# EAGLE design pardisplay (EAGLE 7.6.0)
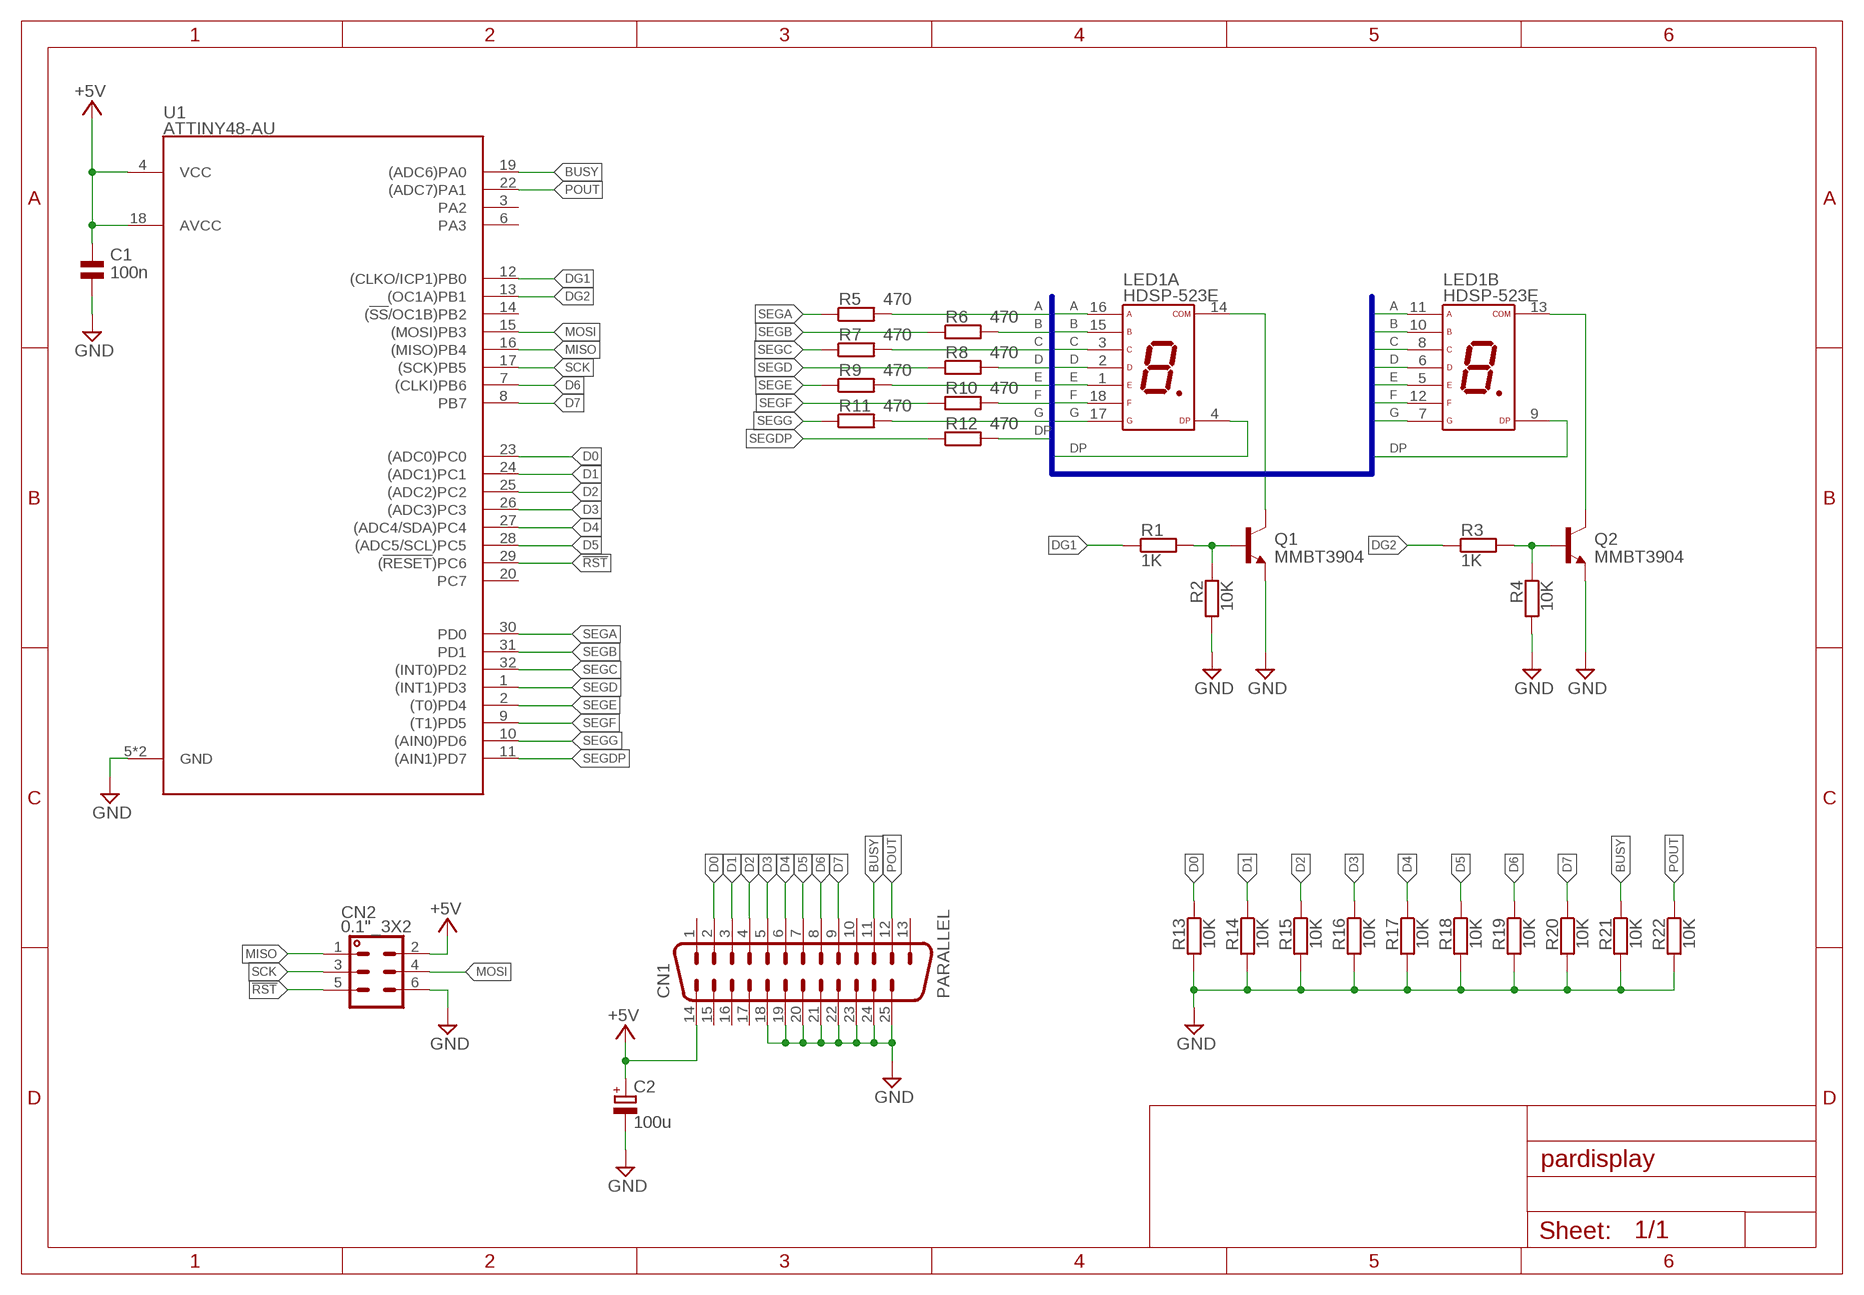
[diagram p0: schematic, sheet 1]

## Parts
C1  100n  CAP_NPOL-0603  [0603]
C2  100u  CPOL-EUUD-6,3X8,8  [UD-6,3X5,8_NICHICON]
CN1  PARALLEL  M25HP  [M25HP]
CN2  0.1"_3X2  [0.1"_3X2-LONG]
LED1  HDSP-523E  KINGBRIGHT_DA56  [DA56]
Q1  MMBT3904  -NPN_SOT23  [SOT23]
Q2  MMBT3904  -NPN_SOT23  [SOT23]
R1  1K  RES-SMD_0603  [0603]
R2  10K  RES-SMD_0603  [0603]
R3  1K  RES-SMD_0603  [0603]
R4  10K  RES-SMD_0603  [0603]
R5  470  RES-SMD_0603  [0603]
R6  470  RES-SMD_0603  [0603]
R7  470  RES-SMD_0603  [0603]
R8  470  RES-SMD_0603  [0603]
R9  470  RES-SMD_0603  [0603]
R10  470  RES-SMD_0603  [0603]
R11  470  RES-SMD_0603  [0603]
R12  470  RES-SMD_0603  [0603]
R13  10K  RES-SMD_0603  [0603]
R14  10K  RES-SMD_0603  [0603]
R15  10K  RES-SMD_0603  [0603]
R16  10K  RES-SMD_0603  [0603]
R17  10K  RES-SMD_0603  [0603]
R18  10K  RES-SMD_0603  [0603]
R19  10K  RES-SMD_0603  [0603]
R20  10K  RES-SMD_0603  [0603]
R21  10K  RES-SMD_0603  [0603]
R22  10K  RES-SMD_0603  [0603]
U1  ATTINY48-AU  [TQFP32-08]

## Nets
!RST: CN2.5 U1.29((!RESET!)PC6)
+5V: C1.1 C2.+ CN1.14 CN2.2 U1.4(VCC) U1.18(AVCC)
A: LED1.11(B:A) LED1.16(A:A) R5.2
B: LED1.10(B:B) LED1.15(A:B) R6.2
BUSY: CN1.11 R21.1 U1.19((ADC6)PA0)
C: LED1.3(A:C) LED1.8(B:C) R7.2
COM1: LED1.14(A:COM) Q1.3(C)
COM2: LED1.13(B:COM) Q2.3(C)
D: LED1.2(A:D) LED1.6(B:D) R8.2
D0: CN1.2 R13.1 U1.23((ADC0)PC0)
D1: CN1.3 R14.1 U1.24((ADC1)PC1)
D2: CN1.4 R15.1 U1.25((ADC2)PC2)
D3: CN1.5 R16.1 U1.26((ADC3)PC3)
D4: CN1.6 R17.1 U1.27((ADC4/SDA)PC4)
D5: CN1.7 R18.1 U1.28((ADC5/SCL)PC5)
D6: CN1.8 R19.1 U1.7((CLKI)PB6)
D7: CN1.9 R20.1 U1.8(PB7)
DG1: R1.1 U1.12((CLKO/ICP1)PB0)
DG2: R3.1 U1.13((OC1A)PB1)
DP: LED1.4(A:DP) LED1.9(B:DP) R12.2
E: LED1.1(A:E) LED1.5(B:E) R9.2
F: LED1.12(B:F) LED1.18(A:F) R10.2
G: LED1.7(B:G) LED1.17(A:G) R11.2
GND: C1.2 C2.- CN1.18 CN1.19 CN1.20 CN1.21 CN1.22 CN1.23 CN1.24 CN1.25 CN2.6 Q1.2(E) Q2.2(E) R2.2 R4.2 R13.2 R14.2 R15.2 R16.2 R17.2 R18.2 R19.2 R20.2 R21.2 R22.2 U1.5(GND) U1.21(GND)
MISO: CN2.1 U1.16((MISO)PB4)
MOSI: CN2.4 U1.15((MOSI)PB3)
N$11: Q1.1(B) R1.2 R2.1
N$12: Q2.1(B) R3.2 R4.1
POUT: CN1.12 R22.1 U1.22((ADC7)PA1)
SCK: CN2.3 U1.17((SCK)PB5)
SEGA: R5.1 U1.30(PD0)
SEGB: R6.1 U1.31(PD1)
SEGC: R7.1 U1.32((INT0)PD2)
SEGD: R8.1 U1.1((INT1)PD3)
SEGDP: R12.1 U1.11((AIN1)PD7)
SEGE: R9.1 U1.2((T0)PD4)
SEGF: R10.1 U1.9((T1)PD5)
SEGG: R11.1 U1.10((AIN0)PD6)
Unconnected: CN1.1 CN1.10 CN1.13 CN1.15 CN1.16 CN1.17 U1.3(PA2) U1.6(PA3) U1.14((!SS!/OC1B)PB2) U1.20(PC7)

## Buses
A,B,C,D,E,F,G,DP

## Library data of the parts
C1 = jc-passive:CAP_NPOL
C2 = rcl:CPOL-EU: POLARIZED CAPACITOR, European symbol
CN1 = con-subd:M25: SUB-D; OC_FARNELL: unknown; OC_NEWARK: unknown
CN2 = jc-connectors:0.1"_3X2; LABEL: ISP
LED1 = jc-display:KINGBRIGHT_DA56: Kingbright DA56 series Avago HDSP-52X series
Q1 Q2 = jc-discretesemi:*-NPN_?
R1-R22 = jc-passive:RES
U1 = jc-atmel avr:ATTINY*8-

## Board
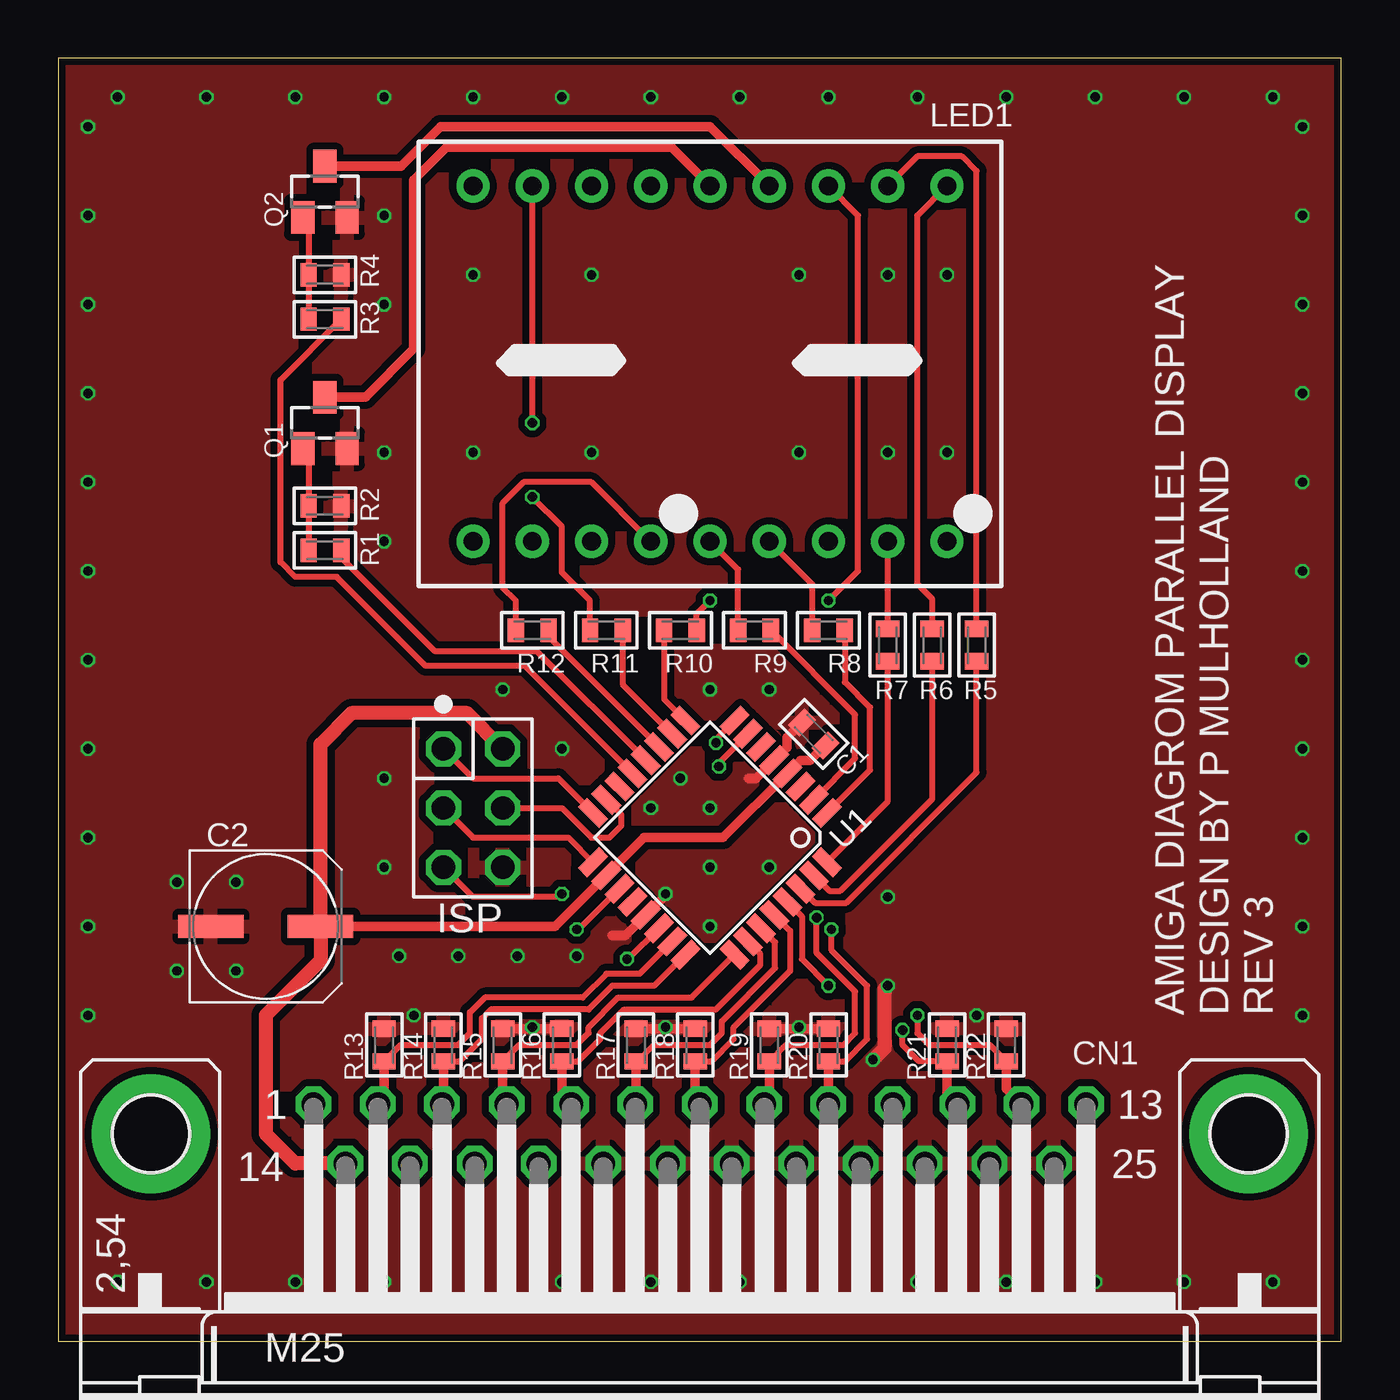
[diagram p1: board, top side]
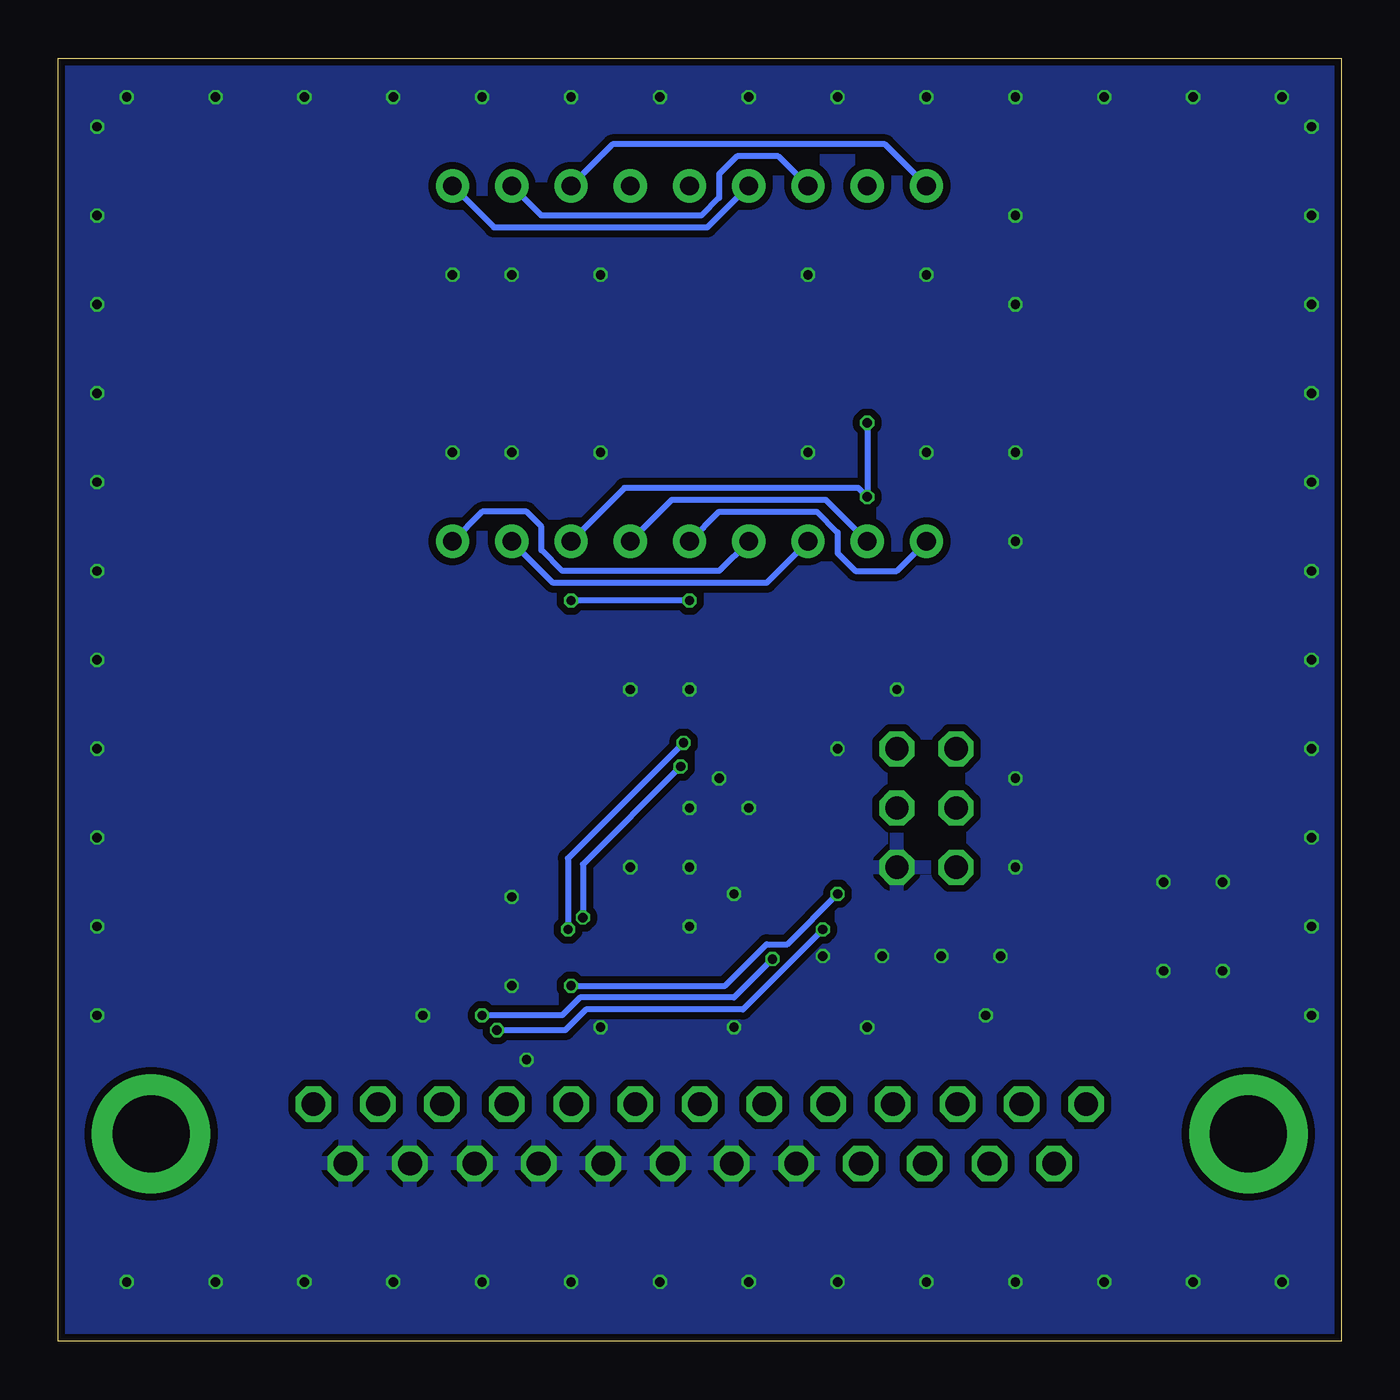
[diagram p2: board, bottom side, seen from below]

Size 55 x 55 mm. Coordinates in mm from the lower left corner, seen from the top.
Outline: 0,0 55,0 55,55 0,55 0,0
Copper layers (1*16): Top 0.035mm / dielectric 0.2mm / Bottom 0.035mm
Design rules "jlcpcb-2layers": minimum track width 3.5mil, minimum drill 0.2mm, track to track 5mil, track to pad 5mil, pad to pad 5mil, via to via 5mil, smd to smd 0mil, copper to edge 0.1mm, drill to drill 5mil, minimum pad ring 4mil, minimum via ring 4mil, stop-mask expansion 3mil, vias tented up to drill 100mil, thermal gap 10mil
tRestrict: 2 lines

### Footprints (pad centres in the part's own frame; a part is rotated, then mirrored left to right if it is on the bottom)
0603 = smd 0.7 x 1: 1 -0.7,0; 2 0.7,0
UD-6,3X5,8_NICHICON = smd 2.8 x 1: + 2.35,0; - -2.35,0
M25HP = drill 1.016 octagon: 1 -16.561,1.27; 2 -13.792,1.27; 3 -11.049,1.27; 4 -8.28,1.27; 5 -5.512,1.27; 6 -2.769,1.27; 7 0,1.27; 8 2.769,1.27; 9 5.512,1.27; 10 8.28,1.27; 11 11.049,1.27; 12 13.792,1.27; 13 16.561,1.27; 14 -15.189,-1.27; 15 -12.421,-1.27; 16 -9.652,-1.27; 17 -6.909,-1.27; 18 -4.14,-1.27; 19 -1.372,-1.27; 20 1.372,-1.27; 21 4.14,-1.27; 22 6.909,-1.27; 23 9.652,-1.27; 24 12.421,-1.27; 25 15.189,-1.27 | drill 3.302 pad 5.08: G1 -23.52,0; G2 23.52,0
0.1"_3X2-LONG = drill 1 octagon: 1 -2.54,-1.27; 2 -2.54,1.27; 3 0,-1.27; 4 0,1.27; 5 2.54,-1.27; 6 2.54,1.27
DA56 = drill 0.8 pad 1.422: 1 -10.16,-7.62; 2 -7.62,-7.62; 3 -5.08,-7.62; 4 -2.54,-7.62; 5 0,-7.62; 6 2.54,-7.62; 7 5.08,-7.62; 8 7.62,-7.62; 9 10.16,-7.62; 10 10.16,7.62; 11 7.62,7.62; 12 5.08,7.62; 13 2.54,7.62; 14 0,7.62; 15 -2.54,7.62; 16 -5.08,7.62; 17 -7.62,7.62; 18 -10.16,7.62
SOT23 = smd 1 x 1.4: 1 -0.95,-1.1; 2 0.95,-1.1; 3 0,1.1
TQFP32-08 = smd 1.27 x 0.559: 1 -4.293,2.8; 2 -4.293,2; 3 -4.293,1.2; 4 -4.293,0.4; 5 -4.293,-0.4; 6 -4.293,-1.2; 7 -4.293,-2; 8 -4.293,-2.8; 17 4.293,-2.8; 18 4.293,-2; 19 4.293,-1.2; 20 4.293,-0.4; 21 4.293,0.4; 22 4.293,1.2; 23 4.293,2; 24 4.293,2.8 | smd 0.559 x 1.27: 9 -2.8,-4.293; 10 -2,-4.293; 11 -1.2,-4.293; 12 -0.4,-4.293; 13 0.4,-4.293; 14 1.2,-4.293; 15 2,-4.293; 16 2.8,-4.293; 25 2.8,4.293; 26 2,4.293; 27 1.2,4.293; 28 0.4,4.293; 29 -0.4,4.293; 30 -1.2,4.293; 31 -2,4.293; 32 -2.8,4.293

### Placement (x,y rotation side)
C1  32.38,26.04 135 top
C2  8.89,17.78 0 top
CN1  27.5,8.89 0 top
CN2  17.78,22.86 270 top
LED1  27.94,41.91 0 top
Q1  11.43,39.37 0 top
Q2  11.43,49.28 0 top
R1  11.43,33.91 180 top
R2  11.43,35.81 0 top
R3  11.43,43.81 180 top
R4  11.43,45.72 0 top
R5  39.37,29.84 90 top
R6  37.47,29.84 90 top
R7  35.56,29.84 90 top
R8  33.02,30.48 180 top
R9  29.84,30.48 180 top
R10  26.67,30.48 0 top
R11  23.5,30.48 180 top
R12  20.32,30.48 180 top
R13  13.97,12.7 90 top
R14  16.51,12.7 90 top
R15  19.05,12.7 90 top
R16  21.59,12.7 90 top
R17  24.77,12.7 90 top
R18  27.3,12.7 90 top
R19  30.48,12.7 90 top
R20  33.02,12.7 90 top
R21  38.1,12.7 90 top
R22  40.64,12.7 90 top
U1  27.94,21.59 225 top

### Tracks (layer width: path | path; a pad name or v marks a point on that pad's centre or on a via)
!RST  (via drill 0.4)
  Top 0.254: U1.29 31.88,18.22 31.88,16.38 v33.02,15.24 | v21.59,19.18 21.46,19.05 17.78,19.05 CN2.5
  Bottom 0.254: v33.02,15.24 26.42,15.24 24.64,17.02 23.75,17.02 v21.59,19.18
+5V
  Top 0.406: C1.1 32.23,24.89 31.81,24.89 U1.4 28.51,21.59 25.11,21.59 U1.18 21.3,17.78 C2.+
  Top 0.61: CN1.14 10.16,7.62 8.89,8.89 8.89,13.97 11.24,16.32 C2.+ 11.24,25.59 12.57,26.92 17.53,26.92 CN2.2
A
  Top 0.254: R5.2 39.37,50.16 38.73,50.8 36.83,50.8 LED1.11
  Bottom 0.254: LED1.16 24.13,50.8 25.91,50.8 26.67,50.04 26.67,49.02 27.43,48.26 34.29,48.26 LED1.11
B
  Top 0.254: LED1.10 36.83,48.26 36.83,32.45 37.47,31.82 R6.2
  Bottom 0.254: LED1.10 36.32,47.75 27.18,47.75 LED1.15
BUSY  (via drill 0.4)
  Top 0.254: U1.19 22.31,17.65 v22.23,17.65 | R21.1 36.9,12 36.2,12.7 v36.2,13.34
  Top 0.406: CN1.11 38.1,10.61 R21.1
  Bottom 0.254: v22.23,17.65 25.65,14.22 32.38,14.22 33.27,13.34 v36.2,13.34
C
  Top 0.254: 35.56,30.48 R7.2 LED1.8
  Bottom 0.254: LED1.3 24.64,32.51 33.78,32.51 LED1.8
COM1
  Top 0.406: LED1.14 26.29,51.18 16.64,51.18 15.24,49.78 15.24,42.55 13.16,40.47 Q1.3
COM2
  Top 0.406: LED1.13 27.94,52.07 16.38,52.07 14.69,50.38 Q2.3
D
  Top 0.254: LED1.6 32.32,32.45 R8.2
  Bottom 0.254: LED1.2 22.1,36.07 28.7,36.07 LED1.6
D0
  Top 0.254: U1.23 24.93,15.75 23.5,15.75 22.48,14.73 18.29,14.73 17.65,14.1 17.65,13.21 17.14,12.7 14.67,12.7 R13.1
  Top 0.406: CN1.2 13.97,10.42 R13.1
D1
  Top 0.254: U1.24 25.55,15.24 23.75,15.24 22.73,14.22 18.54,14.22 18.16,13.84 18.16,12.95 17.21,12 R14.1
  Top 0.406: CN1.3 16.51,10.22 R14.1
D2
  Top 0.254: U1.25 27.15,14.73 24,14.73 22.73,13.46 22.73,13.21 22.23,12.7 19.75,12.7 R15.1
  Top 0.406: CN1.4 19.05,10.33 R15.1
D3
  Top 0.254: U1.26 30.1,16.6 30.1,16.13 28.19,14.22 24.26,14.22 23.24,13.21 23.24,12.95 22.29,12 R16.1
  Top 0.406: CN1.5 21.59,10.56 R16.1
D4
  Top 0.254: U1.27 30.73,17.1 30.73,16 28.45,13.72 28.45,13.21 27.94,12.7 25.53,12.7 24.83,12 R17.1
  Top 0.406: CN1.6 24.77,10.19 R17.1
D5
  Top 0.254: U1.28 31.37,17.59 31.37,15.88 28.96,13.46 28.96,12.95 28,12 R18.1
  Top 0.406: CN1.7 27.3,10.36 R18.1
D6  (via drill 0.4)
  Top 0.254: U1.7 28.32,24.8 v28.32,24.64 | v32.51,18.16 32.51,16.64 34.16,14.99 34.16,13.21 33.66,12.7 31.18,12.7 R19.1
  Top 0.406: CN1.8 30.48,10.37 R19.1
  Bottom 0.254: v28.32,24.64 32.51,20.45 v32.51,18.16
D7  (via drill 0.4)
  Top 0.254: U1.8 28.19,25.8 v28.19,25.65 | R20.1 33.72,12 34.67,12.95 34.67,15.24 33.15,16.76 v33.15,17.65
  Top 0.406: CN1.9 R20.1
  Bottom 0.254: v28.19,25.65 33.15,20.7 v33.15,17.65
DG1
  Top 0.254: R1.1 12.13,33.59 16.13,29.59 20.5,29.59 U1.12
DG2
  Top 0.254: U1.13 20.01,28.96 15.75,28.96 11.94,32.77 10.16,32.77 9.53,33.4 9.53,41.21 R3.1
DP
  Top 0.254: LED1.4 22.86,36.83 19.94,36.83 19.05,35.94 19.05,32.32 19.62,31.75 R12.2
  Bottom 0.254: LED1.4 26.67,33.02 33.4,33.02 34.29,33.91 34.29,34.92 34.92,35.56 36.83,35.56 LED1.9
E
  Top 0.254: R9.2 29.14,33.09 LED1.5
  Bottom 0.254: LED1.5 26.67,35.56 22.48,35.56 21.59,34.67 21.59,33.78 20.83,33.02 19.05,33.02 LED1.1
F  (via drill 0.4)
  Top 0.254: v33.02,31.75 34.29,33.02 34.29,48.26 LED1.12 | R10.2 27.37,31.18 v27.94,31.75
  Bottom 0.254: LED1.18 19.56,51.31 31.24,51.31 LED1.12 | v27.94,31.75 v33.02,31.75
G  (via drill 0.4)
  Top 0.254: v20.32,36.2 21.59,34.92 21.59,32.95 22.8,31.75 R11.2 | LED1.17 v20.32,39.37
  Bottom 0.254: LED1.7 30.73,36.58 20.7,36.58 v20.32,36.2 v20.32,39.37
GND  (via drill 0.4)
  Top 0.406: 29.59,24.13 29.91,24.13 U1.5 31.24,25.46 31.24,25.88 C1.2 | v26.04,19.18 26.04,19.12 U1.21 24.32,17.4 23.75,17.4 | R16.2 20.32,13.4 | R15.2 20.32,13.4 | 20.32,13.4 v20.32,13.46 | R17.2 26.04,13.4 | R18.2 26.04,13.4 | 26.04,13.4 v26.04,13.46 | R20.2 31.75,13.4 | R19.2 31.75,13.4 | 31.75,13.4 v31.75,13.46
  Top 0.61: v34.92,12.06 35.43,12.57 35.43,14.73 35.43,15.11 v35.56,15.24
  other vias: 13.97,38.1 13.97,34.29 13.97,48.26 13.97,44.45 1.27,13.97 1.27,17.78 1.27,21.59 1.27,25.4 1.27,29.21 1.27,33.02 1.27,36.83 1.27,40.64 1.27,44.45 1.27,48.26 1.27,52.07 2.54,53.34 6.35,53.34 10.16,53.34 13.97,53.34 17.78,53.34 21.59,53.34 25.4,53.34 29.21,53.34 33.02,53.34 36.83,53.34 40.64,53.34 44.45,53.34 48.26,53.34 52.07,53.34 53.34,13.97 53.34,17.78 53.34,21.59 53.34,25.4 53.34,29.21 53.34,33.02 53.34,36.83 53.34,40.64 53.34,44.45 53.34,48.26 53.34,52.07 13.97,24.13 25.4,22.86 27.94,22.86 27.94,17.78 26.67,24.13 27.94,20.32 17.78,45.72 17.78,38.1 22.86,45.72 31.75,38.1 35.56,45.72 35.56,38.1 38.1,38.1 38.1,45.72 31.75,45.72 22.86,38.1 27.94,27.94 30.48,27.94 2.54,2.54 6.35,2.54 10.16,2.54 13.97,2.54 17.78,2.54 21.59,2.54 25.4,2.54 29.21,2.54 33.02,2.54 36.83,2.54 40.64,2.54 44.45,2.54 48.26,2.54 52.07,2.54 35.56,19.05 22.23,16.51 19.68,16.51 30.48,20.32 21.59,25.4 17.14,16.51 39.37,13.97 15.24,13.97 19.05,27.94 5.08,19.68 7.62,19.68 5.08,15.88 7.62,15.88 13.97,20.32 14.61,16.51
  pour Bottom (isolate 0.305): 0,55.88 55.88,55.88 55.88,0 0,0
  pour Top (isolate 0.305): 0,55.88 55.88,55.88 55.88,0 0,0
MISO
  Top 0.254: CN2.1 17.78,24.13 21.44,24.13 U1.16
MOSI
  Top 0.254: CN2.4 21.59,22.86 22.86,21.59 23.62,21.59 24.13,22.1 24.13,22.57 U1.15
N$11
  Top 0.254: R1.2 R2.1 10.73,38.27 Q1.1
N$12
  Top 0.254: R3.2 R4.1 10.73,48.18 Q2.1
POUT  (via drill 0.4)
  Top 0.254: U1.22 24.43,16.38 v24.38,16.38 | v36.83,13.97 36.83,13.21 37.34,12.7 39.94,12.7 R22.1
  Top 0.406: CN1.12 40.64,10.81 R22.1
  Bottom 0.254: v24.38,16.38 26.04,14.73 32.64,14.73 33.4,13.97 v36.83,13.97
SCK
  Top 0.254: CN2.3 17.78,21.59 21.87,21.59 U1.17
SEGA
  Top 0.254: U1.30 32.43,18.8 33.78,18.8 39.37,24.38 R5.1
SEGB
  Top 0.254: U1.31 33.05,19.3 33.53,19.3 37.47,23.24 R6.1
SEGC
  Top 0.254: U1.32 35.56,23.14 R7.1
SEGD
  Top 0.254: U1.1 34.8,24.49 34.8,27.18 33.72,28.26 R8.1
SEGDP
  Top 0.254: R12.1 21.02,30.21 U1.11
SEGE
  Top 0.254: U1.2 34.16,24.98 34.16,26.86 R9.1
SEGF
  Top 0.254: R10.1 25.97,27.52 U1.9
SEGG
  Top 0.254: R11.1 24.2,28.16 U1.10

### Text on the board
tPlace: ISP | AMIGA DIAGROM PARALLEL DISPLAY | DESIGN BY P MULHOLLAND | REV 3